# Altium schematic sheet galv.Trennung_Verstaerkung.SchDoc
size A4; CompanyName: Technische Hochschule Nürnberg Georg Simon Ohm; Address1: Fürther Straße 250; Address2: 90429 Nürnberg; Address3: GERMANY; SheetNumber: 6; SheetTotal: 6; CompanyName2: Institut ELSYS
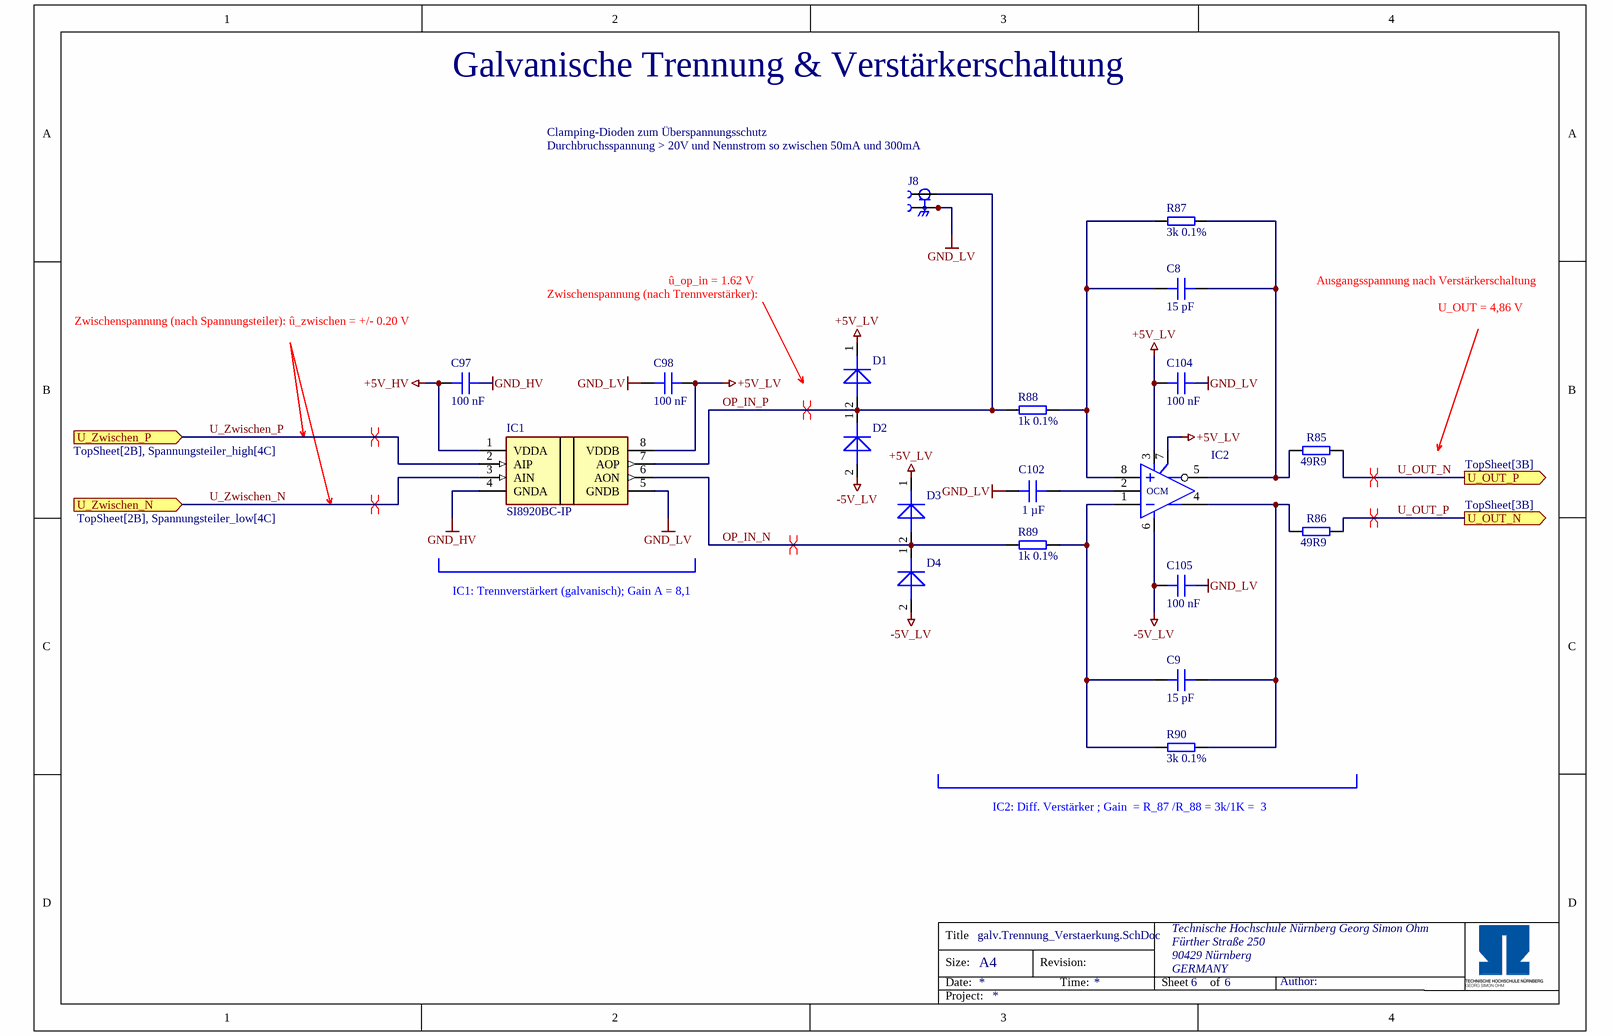
[diagram p0: galv.Trennung_Verstaerkung.SchDoc]

## Parts
C8  15 pF  [C_0805]
C9  15 pF  [C_0805]
C97  100 nF  [C_0603]
C98  100 nF  [C_0603]
C102  1 µF  [C_0603]
C104  100 nF  [C_0603]
C105  100 nF  [C_0603]
D1  1SS356VMFHTE-17  [1SS356VMFHTE17]  (value not drawn)
D2  1SS356VMFHTE-17  [1SS356VMFHTE17]  (value not drawn)
D3  1SS356VMFHTE-17  [1SS356VMFHTE17]  (value not drawn)
D4  1SS356VMFHTE-17  [1SS356VMFHTE17]  (value not drawn)
IC1  SI8920BC-IP  [SI8920BCIP]
IC2  ADA4940-1ARZ-R7  [SOIC-8-N]  (value not drawn)
J8  BNC5-J-P-GN-ST-TH2D_new  [BNC5-J-P-GN-ST-TH2D_new]  (value not drawn)
R85  49R9  [RES 0603_1608]
R86  49R9  [RES 0603_1608]
R87  3k 0.1%  [R1206_3216]
R88  1k 0.1%  [R1206_3216]
R89  1k 0.1%  [R1206_3216]
R90  3k 0.1%  [R1206_3216]

## Ports
U_OUT_N (out, see TopSheet[3B]), U_OUT_P (out, see TopSheet[3B]), U_Zwischen_N (in, see TopSheet[2B], Spannungsteiler_low[4C]), U_Zwischen_P (in, see TopSheet[2B], Spannungsteiler_high[4C])

## Nets
+5V_HV: C97.1 IC1.1(VDDA)
+5V_LV: C98.2 C104.1 D1.1(K) D3.1(K) IC1.8(VDDB) IC2.3(V+) IC2.7(EN)
-5V_LV: C105.1 D2.2(A) D4.2(A) IC2.6(V-)
GND_HV: C97.2 IC1.4(GNDA)
GND_LV: C98.1 C102.1 C104.2 C105.2 IC1.5(GNDB) J8.S_1 J8.S_2 J8.S_3
OP_IN_N: D3.2(A) D4.1(K) IC1.6(AON) R89.1
OP_IN_P: D1.2(A) D2.1(K) IC1.7(AOP) J8.1 R88.1
U_OUT_N: R85.2 ; port U_OUT_P
U_OUT_P: R86.2 ; port U_OUT_N
U_Zwischen_N: IC1.3(AIN) ; port U_Zwischen_N
U_Zwischen_P: IC1.2(AIP) ; port U_Zwischen_P
NetC8_1: C8.1 IC2.8(+) R87.1 R88.2
NetC8_2: C8.2 IC2.5(Out) R85.1 R87.2
NetC9_1: C9.1 IC2.1(-) R89.2 R90.1
NetC9_2: C9.2 IC2.4(Out) R86.1 R90.2
NetC102_2: C102.2 IC2.2(OCM)

## Layout directives
differential pair: OP_IN_N, OP_IN_P, U_OUT_N, U_OUT_P, U_Zwischen_N, U_Zwischen_P

## Notes on the sheet
- Galvanische Trennung & Verstärkerschaltung
- Clamping-Dioden zum Überspannungsschutz
- (near J8) Durchbruchsspannung > 20V und Nennstrom so zwischen 50mA und 300mA
- Zwischenspannung (nach Trennverstärker):
- û_op_in = 1.62 V
- Ausgangsspannung nach Verstärkerschaltung
- U_OUT = 4,86 V
- Zwischenspannung (nach Spannungsteiler): û_zwischen = +/- 0.20 V
- IC1: Trennverstärkert (galvanisch); Gain A = 8,1
- IC2: Diff. Verstärker ; Gain  = R_87 /R_88 = 3k/1K =  3
- Title
- Size:
- Date:
- A4
- Revision:
- Time:
- Sheet
- of
- Author:
- Project:

## Library data of the parts
C8 C9 = 08053C150KAT2A: Capacitor 0805, 25 VDC, 15 pF, X7R; Manufacturer: AVX; Tolerance: 10 %; Voltage Rating: 25 VDC; Created from: MGremer; Manufacturer Part Number: 08053C150KAT2A; PartID: 18; Created On: 20.12.2020 13:54:13; ComponentLink1Description: Datasheet; ComponentLink1URL: https://www.mouser.de/datasheet/2/40/X7RDielectric-777024.pdf; Component Type: Capacitor 0805; Device Package: 0805; Last Updated: 20.12.2020 16:34:30; Mounting Type: SMD; Operating Temperature: -55 - 125°C; Series: MLCC X7R; Supplier 1: Mouser; Supplier Part Number 1: 581-08053C150KAT2A; Type: Capacitor; Value: 15 pF; Live Cycle Status: 1; Stock number: Labor SMD Container
C97 C98 C104 C105 = C0603C104K9PACTU: Capacitor 0603, 6.3 VDC, 100 nF, X5R; Manufacturer: KEMET; Tolerance: 10 %; Voltage Rating: 6.3 VDC; Created from: MGremer; Manufacturer Part Number: C0603C104K9PACTU; PartID: 70; Created On: 20.12.2020 13:54:13; ComponentLink1Description: Datasheet; ComponentLink1URL: https://www.mouser.de/datasheet/2/212/KEM_C1006_X5R_SMD-1103249.pdf; Component Type: Capacitor 0603; Device Package: 0603; Last Updated: 20.01.2021 13:57:36; Mounting Type: SMD; Operating Temperature: -55 - 85°C; Series: SMD Comm X5R; Supplier 1: Mouser; Supplier Part Number 1: 80-C0603C104K9P; Type: Capacitor; Value: 100 nF; Live Cycle Status: 1; Stock number: not stored
C102 = CL10A105KB8NNNC: 50V 1uF X5R ±10% 0603  Multilayer Ceramic Capacitors MLCC - SMD/SMT ROHS; Manufacturer: Samsung Electro-Mechanics; Voltage Rating: 50 VDC; Created from: MGremer; Supplier 1: LCSC; Supplier Part Number 1: C15849; Manufacturer Part Number: CL10A105KB8NNNC; Value: 1 µF; PartID: 5; Created On: 20.12.2020 13:54:13; ComponentLink1Description: Datasheet; ComponentLink1URL: https://datasheet.lcsc.com/lcsc/1810261812_Samsung-Electro-Mechanics-CL10A105KB8NNNC_C15849.pdf; Component Type: Capacitor 0603; Device Package: 0603; Last Updated: 28.11.2022 17:23:01; Mounting Type: SMD; Operating Temperature: -55 - 85°C; Series: M; Type: Capacitor; Tolerance: 10 %; Live Cycle Status: 1; LCSC Part Number: C15849; Stock number: Labor SMD Container
D1-D4 = 1SS356VMFHTE-17: Diode; Manufacturer_Name: ROHM Semiconductor; Datasheet Link: https://fscdn.rohm.com/en/products/databook/datasheet/discrete/diode/switching/1ss355vmfhte-17-e.pdf; Height: 0.9mm; Manufacturer_Part_Number: 1SS356VMFHTE-17; Mouser Part Number: 755-1SS356VMFHTE-17; Mouser Price/Stock: https://www.mouser.co.uk/ProductDetail/ROHM-Semiconductor/1SS356VMFHTE-17?qs=doiCPypUmgG12xHjyvfQdg%3D%3D; Supplier 1: Mouser; Supplier Part Number 1: 755-1SS356VMFHTE-17
IC1 = SI8920BC-IP: Integrated Circuit - Trennverstärker Isolated analog amplifier with 200 mV input; Manufacturer_Name: Skyworks Solutions Inc; Datasheet Link: https://www.skyworksinc.com/-/media/Skyworks/SL/documents/public/data-sheets/si8920-datasheet.pdf; Height: 4.19mm; Manufacturer_Part_Number: SI8920BC-IP; Mouser Part Number: 634-SI8920BC-IP; Mouser Price/Stock: 6,74 €; Supplier 1: Farnell; Supplier Part Number 1: 2930395
IC2 = ADA4940-1ARZ-R7: Differential ADC Driver; Manufacturer: Analog Devices; Class I: Analog; Class II: Fully Differential ADC Drivers (-40-125°C); Best.-Nr.: Farnell 209-6178; Channels: 1; Created from: MGremer; Datasheet: DSO11449, Ver. Aug 2000; Last edited: 04.01.2007 10:14; Package Reference: SOIC-N-8; Manufacturer Part Number: ADA4940-1ARZ-R7; PartID: 3; Created On: 15.01.2021 12:16:53; ComponentLink1Description: Datasheet; ComponentLink1URL: https://www.mouser.de/datasheet/2/609/ADA4940-1_4940-2-878284.pdf; Component Type: ADC; Device Package: SOIC-8; Last Updated: 22.11.2021 15:19:18; Mounting Type: SMD; Operating Temperature: -40 - 105 °C; Supplier 1: Mouser; Supplier Part Number 1: 584-ADA4940-1ARZ-R7; Type: ADC; Resolution: -; Value: differential ADC driver; Live Cycle Status: 1; Stock number: not stored
J8 = BNC5-J-P-GN-ST-TH2D_new: BNC Connector; Supplier 1: Mouser; Supplier Part Number 1: 200-BNC5JPGNSTTH2D
R85 R86 = RC0603FR-0749R9L: 100mW Thick Film Resistors ±100ppm/℃ ±1% 49.9Ω 0603 Chip Resistor - Surface Mount ROHS; Manufacturer: YAGEO; Created from: AGeiger; Value: 49R9; Manufacturer Part Number: RC0603FR-0749R9L; PartID: 277; Created On: 14.06.2023 17:42:26; ComponentLink1Description: Datasheet; ComponentLink1URL: https://datasheet.lcsc.com/lcsc/2304140030_YAGEO-RC0603FR-0749R9L_C114625.pdf; Component Type: SMD resistor; Device Package: 0603; Last Updated: 14.06.2023 17:42:26; Mounting Type: SMD; Type: Resistor; Tolerance: 1%; Live Cycle Status: 1; LCSC Part Number: C114625; Supplier 1: Mouser; Supplier Part Number 1: 603-RC0603FR-0749R9L
R87 R90 = ERA-8AEB302V: Resistor - SMD 1206 3.0Kohm 0.1% 25ppm; Manufacturer: Panasonic; Man. Part Number: ERA-8AEB302V; Value: 3k; Supplier 1: Mouser; Supplier Part Number 1: 667-ERA-8AEB302V
R88 R89 = ERA-8AEB102V: Resistor - SMD 1206 1.0Kohm 0.1% 25ppm; Manufacturer: Panasonic; Supplier 1: Mouser; Supplier Part Number 1: 667-ERA-8AEB102V; Man. Part Number: ERA-8AEB102V; Value: 1k